# Altium schematic sheet Motor Drivers.SchDoc
size A4; SheetNumber: 4; SheetTotal: 4
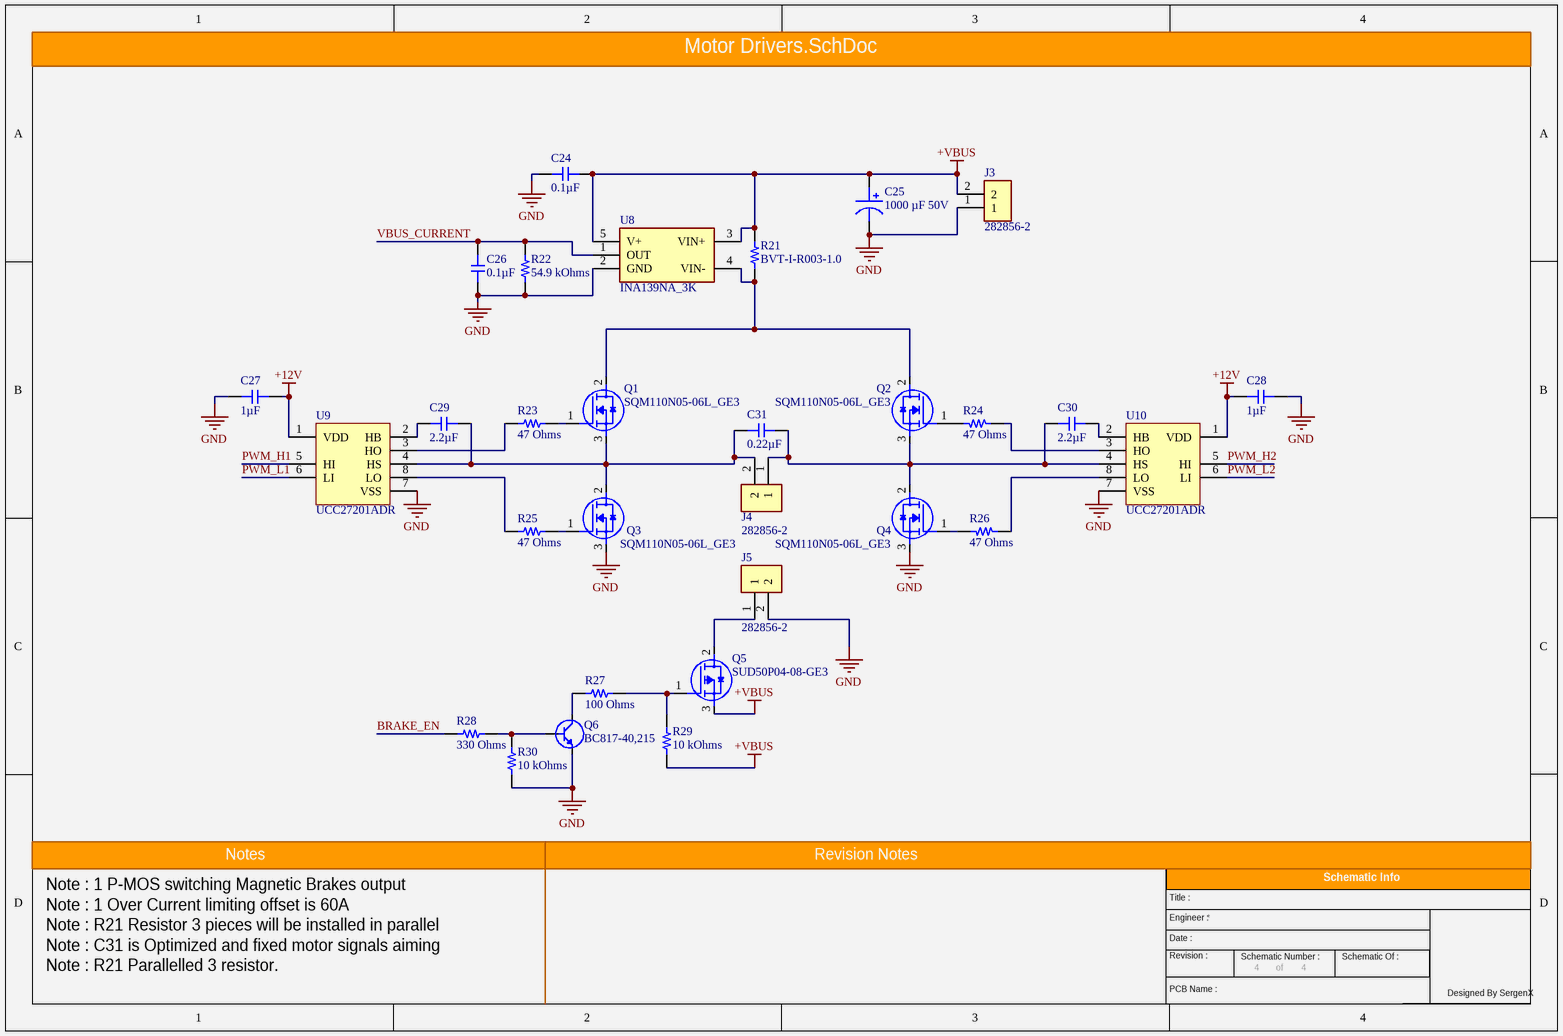
[diagram p0: Motor Drivers.SchDoc]

## Parts
C24  0.1µF  [0603_Footprint]
C25  1000 µF 50V  [CAPPRD500W60D1250H2500]
C26  0.1µF  [0603_Footprint]
C27  1µF  [0603_Footprint]
C28  1µF  [0603_Footprint]
C29  2.2µF  [0805]
C30  2.2µF  [0805]
C31  0.22µF  [0805]
J3  282856-2  [TE_282856-2]
J4  282856-2  [TE_282856-2]
J5  282856-2  [TE_282856-2]
Q1  SQM110N05-06L_GE3  [DPAK254P1524X457-3N]
Q2  SQM110N05-06L_GE3  [DPAK254P1524X457-3N]
Q3  SQM110N05-06L_GE3  [DPAK254P1524X457-3N]
Q4  SQM110N05-06L_GE3  [DPAK254P1524X457-3N]
Q5  SUD50P04-08-GE3  [TO-252]
Q6  BC817-40,215  [BC81740215]
R21  BVT-I-R003-1.0  [BVTIR00310]
R22  54.9 kOhms  [0603_RES]
R23  47 Ohms  [0603_RES]
R24  47 Ohms  [0603_RES]
R25  47 Ohms  [0603_RES]
R26  47 Ohms  [0603_RES]
R27  100 Ohms  [0603_RES]
R28  330 Ohms  [0603_RES]
R29  10 kOhms  [0603_RES]
R30  10 kOhms  [0603_RES]
U8  INA139NA_3K  [SOT95P280X145-5N]
U9  UCC27201ADR  [SOIC127P599X175-8N]
U10  UCC27201ADR  [SOIC127P599X175-8N]

## Nets
+12V: C27.2 C28.2 U9.1(VDD) U10.1(VDD)
+VBUS: C24.1 C25.P J3.2 Q5.3(S) R21.2 R29.1 U8.3(VIN+) U8.5(V+)
GND: C24.2 C25.N C26.1 C27.1 C28.1 J3.1 J5.2 Q3.3(S) Q4.3(S) Q6.2(E) R22.1 R30.2 U8.2(GND) U9.7(VSS) U10.7(VSS)
BRAKE_EN: R28.1
PWM_H1: U9.5(HI)
PWM_H2: U10.5(HI)
PWM_L1: U9.6(LI)
PWM_L2: U10.6(LI)
VBUS_CURRENT: C26.2 R22.2 U8.1(OUT)
NetC29_1: C29.1 U9.2(HB)
NetC29_2: C29.2 C31.1 J4.2 Q1.3(S) Q3.2(D) U9.4(HS)
NetC30_1: C30.1 U10.2(HB)
NetC30_2: C30.2 C31.2 J4.1 Q2.3(S) Q4.2(D) U10.4(HS)
NetJ5_1: J5.1 Q5.2(D)
NetQ1_1: Q1.1(G) R23.2
NetQ1_2: Q1.2(D) Q2.2(D) R21.1 U8.4(VIN-)
NetQ2_1: Q2.1(G) R24.2
NetQ3_1: Q3.1(G) R25.2
NetQ4_1: Q4.1(G) R26.2
NetQ5_1: Q5.1(G) R27.2 R29.2
NetQ6_1: Q6.1(B) R28.2 R30.1
NetQ6_3: Q6.3(C) R27.1
NetR23_1: R23.1 U9.3(HO)
NetR24_1: R24.1 U10.3(HO)
NetR25_1: R25.1 U9.8(LO)
NetR26_1: R26.1 U10.8(LO)

## Notes on the sheet
- Note : 1 P-MOS switching Magnetic Brakes output
- Note : 1 Over Current limiting offset is 60A
- Note : R21 Resistor 3 pieces will be installed in parallel
- Note : C31 is Optimized and fixed motor signals aiming
- Note : R21 Parallelled 3 resistor.
- Notes
- Revision Notes
- Title :
- Engineer :
- Schematic Info
- Date :
- Revision :
- PCB Name :
- Schematic Number :
- of
- Schematic Of :
- Designed By SergenX

## Library data of the parts
C24 C26 = 0.1uF 0603 Surface Capacitor
C25 = ECA1HM102: 1000µF 50V Aluminum Electrolytic Capacitors Radial, Can 2000 Hrs @ 85Â°C
C27 C28 = 1uF 0603 Surface Capacitor
C29 C30 = 2.2uF 0805 Surface Capacitor
C31 = 0.22uF 0805 Surface Capacitor
J3-J5 = 282856-2: TERMI-BLOK PCB MOUNT 2P; MF: TE Connectivity; Purchase-URL: https://pricing.snapeda.com/search/part/282856-2/?ref=eda; Package: None; MP: 282856-2; EU_RoHS_Compliance: Compliant with Exemptions; Price: None; Availability: In Stock; Value: *; Check_prices: https://www.snapeda.com/parts/282856-2/TE+Connectivity+AMP+Connectors/view-part/?ref=eda; SnapEDA_Link: https://www.snapeda.com/parts/282856-2/TE+Connectivity+AMP+Connectors/view-part/?ref=snap
Q1-Q4 = SQM110N05-06L_GE3: MOSFET DIS.110A 55V N-CH; MP: IPB60R165CP; MF: Infineon; Availability: In Stock; Package: TO-263 Infineon; SnapEDA_Link: https://www.snapeda.com/parts/IPB60R165CP/Infineon/view-part/?ref=snap; Price: None; Value: *; Check_prices: https://www.snapeda.com/parts/IPB60R165CP/Infineon/view-part/?ref=eda
Q5 = SUD50P04-08-GE3: MOSFET (P-Channel) 50V 40A 8mOhms; Manufacturer_Name: Vishay; Datasheet Link: https://www.vishay.com/docs/65594/sud50p04-08.pdf; Height: 2.38mm; Manufacturer_Part_Number: SUD50P04-08-GE3; Mouser Part Number: 781-SUD50P04-08-GE3; Mouser Price/Stock: https://www.mouser.co.uk/ProductDetail/Vishay-Semiconductors/SUD50P04-08-GE3?qs=WX95TUc1y56BTDQkv3VCeQ%3D%3D; Arrow Part Number: SUD50P04-08-GE3; Arrow Price/Stock: https://www.arrow.com/en/products/sud50p04-08-ge3/vishay?region=europe
Q6 = BC817-40,215: 0.5A 45V BJT NPN Transistor SOT23 SMD; Manufacturer_Name: Nexperia; Datasheet Link: https://assets.nexperia.com/documents/data-sheet/BC817_SER.pdf; Height: 1.1mm; Manufacturer_Part_Number: BC817-40,215; Mouser Part Number: 771-BC817-40-T/R; Mouser Price/Stock: https://www.mouser.co.uk/ProductDetail/Nexperia/BC817-40215?qs=me8TqzrmIYU%252B245p8hOLaQ%3D%3D; Arrow Part Number: BC817-40,215; Arrow Price/Stock: https://www.arrow.com/en/products/bc817-40215/nexperia?region=nac
R21 = BVT-I-R003-1.0: 3mOhm Resistor 2510 SMD Package; Manufacturer_Name: Isabellenhutte; Datasheet Link: https://www.isabellenhuetteusa.com/wp-content/uploads/2020/05/BVT.pdf; Height: 0.38mm; Manufacturer_Part_Number: BVT-I-R003-1.0
R22 = 54.9k Ohm 0603
R23-R26 = 47 Ohm 0603
R27 = 100 Ohm 0603
R28 = 330 Ohm 0603
R29 R30 = 10 kOhms 0603
U8 = INA139NA_3K: %0.5 Current Monitor 60V Analog SMD; Manufacturer_Name: Texas Instruments; Manufacturer_Part_Number: INA139NA/3K; Datasheet Link: http://www.ti.com/lit/gpn/ina139; Height: 1.45mm; Mouser Part Number: 595-INA139NA/3K; Mouser Price/Stock: https://www.mouser.co.uk/ProductDetail/Texas-Instruments/INA139NA-3K?qs=VBduBm9rCJS5yg1Xiaw5Dw%3D%3D; Arrow Part Number: INA139NA/3K; Arrow Price/Stock: https://www.arrow.com/en/products/ina139na3k/texas-instruments?region=nac
U9 U10 = UCC27201ADR: 3-A, 120-V half bridge gate driver with 8-V UVLO and negative voltage handling; MF: Texas Instruments; MP: UCC27201ADR; Price: None; SnapEDA_Link: https://www.snapeda.com/parts/UCC27201ADR/Texas+Instruments/view-part/?ref=snap; Purchase-URL: https://pricing.snapeda.com/search/part/UCC27201ADR/?ref=eda; Availability: In Stock; Check_prices: https://www.snapeda.com/parts/UCC27201ADR/Texas+Instruments/view-part/?ref=eda; Value: *; Package: SOIC-8 Texas Instruments